# EasyEDA Pro project Fuente Estacion de calor.eprj

# Schematic Schematic1
Board Name: Board1; Create Date: 2025-01-22; Page Name: Fuente; Project Name: Fuente Estacion de calor; Schematic Name: Schematic1; Update Date: 2025-01-21; Company: EasyEDA.com; Page Size: A4; Version: V1.0
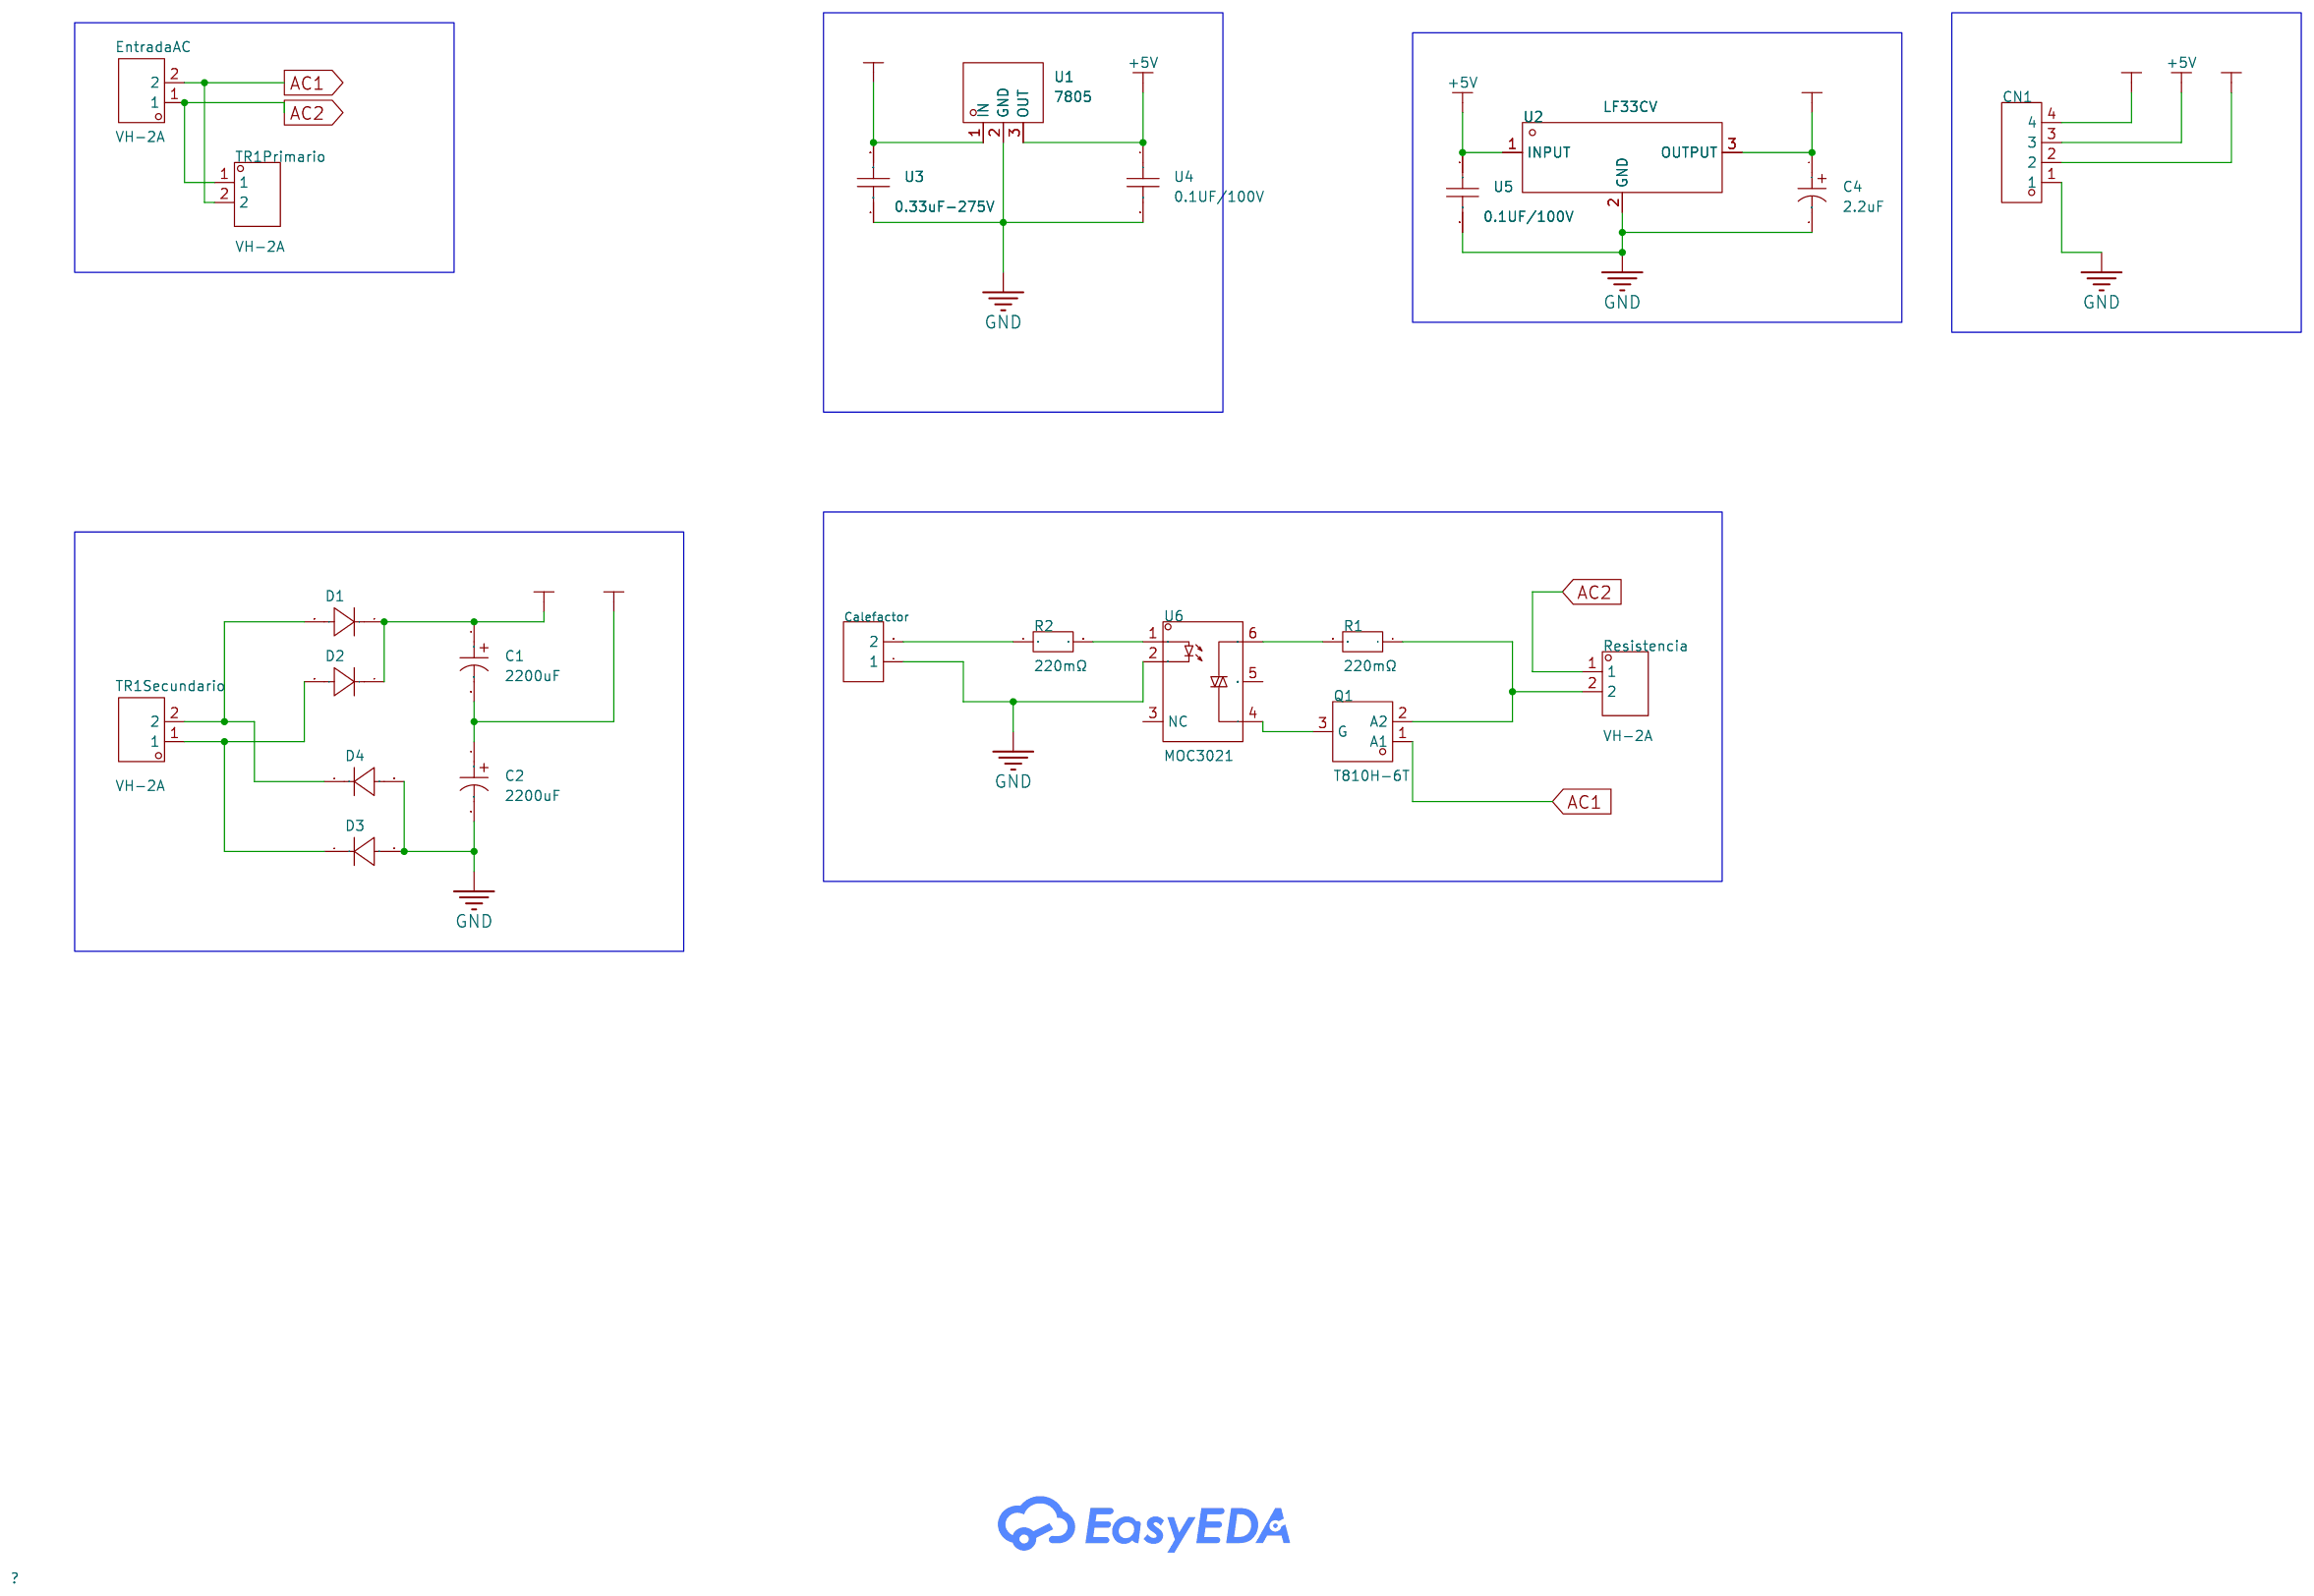
[diagram p0: schematic sheet]

## Parts
C1  2200uF  [CAP-TH_BD18.0-P7.50-D0.8-FD]
C2  2200uF  [CAP-TH_BD18.0-P7.50-D0.8-FD]
C4  2.2uF  [CAP-TH_BD5.0-P2.00-D0.8-FD]
Calefactor  -  [HDR-TH_2P-P2.54-V-F]
CN1  molex 2.54 4P 直针  [CONN-TH_4P-P2.54_C41927]
D1  -  [DO-41_BD2.4-L4.7-P8.70-D0.9-RD]
D2  -  [DO-41_BD2.4-L4.7-P8.70-D0.9-RD]
D3  -  [DO-41_BD2.4-L4.7-P8.70-D0.9-RD]
D4  -  [DO-41_BD2.4-L4.7-P8.70-D0.9-RD]
EntradaAC  VH-2A  [CONN-TH_VH3.96-2A]
Q1  T810H-6T  [ITO-220AB-3_L10.0-W4.5-P2.54-L_1]
R1  220mΩ  [RES-TH_BD2.4-L6.3-P10.30-D0.6]
R2  220mΩ  [RES-TH_BD2.4-L6.3-P10.30-D0.6]
Resistencia  VH-2A  [CONN-TH_VH3.96-2A]
TR1Primario  VH-2A  [CONN-TH_VH3.96-2A]
TR1Secundario  VH-2A  [CONN-TH_VH3.96-2A]
U1  7805  [TO-220-3_L10.0-W4.5-P2.54-L]
U2  LF33CV  [TO-220-3_L10.2-W4.5-P2.54-L]
U3  0.33uF-275V  [CAP-TH_L18.0-W8.4-P15.00-D0.8]
U4  0.1UF/100V  [CAP-TH_L7.0-W3.3-P5.00-D0.4]
U5  0.1UF/100V  [CAP-TH_L7.0-W3.3-P5.00-D0.4]
U6  MOC3021  [DIP-6_L8.5-W6.4-P2.54-LS7.6-BL]

## Library data of the parts
C1 C2 = CD2882281JM1832VFL: LCSC Part Name: 2200uF 63V; Supplier Part: C7493826; Manufacturer: HRK(鸿瑞凯); Supplier Footprint: 插件,D18xL32mm; JLCPCB Part Class: Extended Part; Supplier: LCSC
C4 = 50V2.2uF CD110: LCSC Part Name: 2.2uF ±20% 50V; Supplier Part: C2960206; Manufacturer: HRK(鸿瑞凯电子); Supplier Footprint: 插件,D5xL11mm; JLCPCB Part Class: Extended Part; Datasheet: https://atta.szlcsc.com/upload/public/pdf/source/20220224/498DE033A07BCA0E77D5AA25FF5B4E27.pdf; Supplier: LCSC; Tolerance: ±20%; Operating Temperature: -40℃~+105℃
Calefactor = HDR-F_2.54_1x2P: Supplier Footprint: Through
CN1 = molex 2.54 4P 直针: Supplier Part: C9900020683; Supplier Footprint: molex2.54_4; JLCPCB Part Class: Extended Part; Supplier: LCSC
D1-D4 = 1N4007: Supplier Footprint: DO-41
EntradaAC Resistencia TR1Primario TR1Secundario = VH-2A_C22435737: LCSC Part Name: 1x2P 间距:3.96mm 直插; Supplier Part: C22435737; Manufacturer: DLL(德利); Supplier Footprint: 插件,P=3.96mm; JLCPCB Part Class: Extended Part; Datasheet: https://atta.szlcsc.com/upload/public/pdf/source/20240521/447CE31280736D2A2EC820BDD22F5F15.pdf; Supplier: LCSC; Pins Structure: 1x2P; Pitch: 3.96mm; Mounting Style: Direct Insert; Number of Pins: 2P; Number of Rows: 1; Number of PINs Per Row: 2; Current Rating (Max): 7A; Operating Temperature Range: -40℃~+105℃
Q1 = T810H-6T: Supplier Part: C2971313; Manufacturer: ST(意法半导体); Supplier Footprint: TO-220AB; JLCPCB Part Class: Extended Part; Datasheet: https://atta.szlcsc.com/upload/public/pdf/source/20191219/C472562_6312A7B48CAB40CEF395C5DFD4D8C969.pdf; Supplier: LCSC; Gate Trigger   Voltage (Vgt): 1V; Holding Current (Ih): 25mA; Peak off - state voltage(Vdrm): 600V; Current - Gate Trigger(Igt): 10mA; Current - Surge(Itsm@f): 84A@60Hz; Average Gate Power Dissipation (PG(AV)): 1W; Current - On State(It(RMS)): 8A; Operating Temperature: -40℃~+150℃
R1 R2 = MF0207FTE52-0R22: LCSC Part Name: 金属膜电阻 220mΩ ±1%; Supplier Part: C5120101; Manufacturer: YAGEO(国巨); Supplier Footprint: 插件,D2.4xL6.3mm; JLCPCB Part Class: Extended Part; Datasheet: https://atta.szlcsc.com/upload/public/pdf/source/20220726/D869ABF84827D795EA4F46D364FCE06A.pdf; Supplier: LCSC; Type: Metal Film Resistors; Tolerance: ±1%; Temperature Coefficient: ±50ppm/℃; Operating Temperature: -55℃~+155℃
U1 = 7805_C2843718: Supplier Part: C2843718; Manufacturer: PUOLOP(迪浦); Supplier Footprint: TO-220; JLCPCB Part Class: Extended Part; Datasheet: https://atta.szlcsc.com/upload/public/pdf/source/20210712/C2843718_96B9427BF64C6CE0C1AB214F0C19FF34.pdf; Supplier: LCSC
U2 = LF33CV: LCSC Part Name: 带抑制功能的极低压降稳压器; Supplier Part: C2832779; Manufacturer: ST(意法半导体); Supplier Footprint: TO-220-3; JLCPCB Part Class: Extended Part; Datasheet: https://atta.szlcsc.com/upload/public/pdf/source/20191009/C435902_65B3AAB3204119845CFC8A7586266A6B.pdf; Supplier: LCSC; Output Type: Fixed; Maximum Input Voltage: 16V; Output Voltage: 3.3V; Output Current: 500mA; Dropout Voltage: 700mV@(500mA); standby current: 1mA; Feature: Automotive Standard Certification；Thermal Protection(TSD)；Overcurrent Protection(OCP); Operating Temperature: -40℃~+125℃; Output Polarity: Positive electrode; Number of Outputs: 1
U3 = 0.33uF-275V: Supplier Part: C9900015245; Supplier Footprint: X2_P15; JLCPCB Part Class: Extended Part; Supplier: LCSC
U4 U5 = 0.1UF/100V: Supplier Part: C9900014677; Supplier Footprint: 104; JLCPCB Part Class: Extended Part; Supplier: LCSC
U6 = MOC3021: LCSC Part Name: 双向可控硅 无过零电路 1通道; Supplier Part: C123202; Manufacturer: LITEON(光宝); Supplier Footprint: DIP-6; JLCPCB Part Class: Extended Part; Datasheet: https://atta.szlcsc.com/upload/public/pdf/source/20181205/C123202_F6015C1B1B0CE9E6FC335144C83FD349.pdf; Supplier: LCSC; SCR Type: Two-way thyristor; Zero Crossing Circuit: No; Forward Voltage: 1.15V; Isolation Voltage(rms): 5kV; Forward Current: 50mA; Peak Off-state Voltage(Vdrm): 400V; Static dv/dt: 1000V/us; Number of Outputs: 1; Operating Temperature: -55℃~+110℃

## Nets
12V: C1.2 C2.1 U1.1(IN) U3.2
24V: C1.1 CN1.2 D1.1(K) D2.1(K)
+3.3V: C4.1 CN1.4 U2.3(OUTPUT)
+5V: CN1.3 U1.3(OUT) U2.1(INPUT) U4.1 U5.1
GND: C2.2 C4.2 Calefactor.1 CN1.1 D3.2(A) D4.2(A) U1.2(GND) U2.2(GND) U3.1 U4.2 U5.2 U6.2
AC1: EntradaAC.2 Q1.1(A1) TR1Primario.2
AC2: EntradaAC.1 Resistencia.1 TR1Primario.1
$1N332: D1.2(A) D4.1(K) TR1Secundario.2
$1N337: D2.2(A) D3.1(K) TR1Secundario.1
Net-(Calefactor-2): Calefactor.2 R2.1
Net-(Q1-2): Q1.2(A2) R1.1 Resistencia.2
Net-(Q1-3): Q1.3(G) U6.4(E)
Net-(R1-2): R1.2 U6.6(BASE)
Net-(R2-2): R2.2 U6.1

Not connected (* = marked no-connect by the designer): U6 3(NC) 5(SUB)

# Schematic Schematic2
Board Name: Botones; Create Date: 2025-01-23; Page Name: P1; Project Name: Fuente Estacion de calor; Schematic Name: Schematic2; Update Date: 2025-01-23; Company: EasyEDA.com; Page Size: A4; Version: V1.0
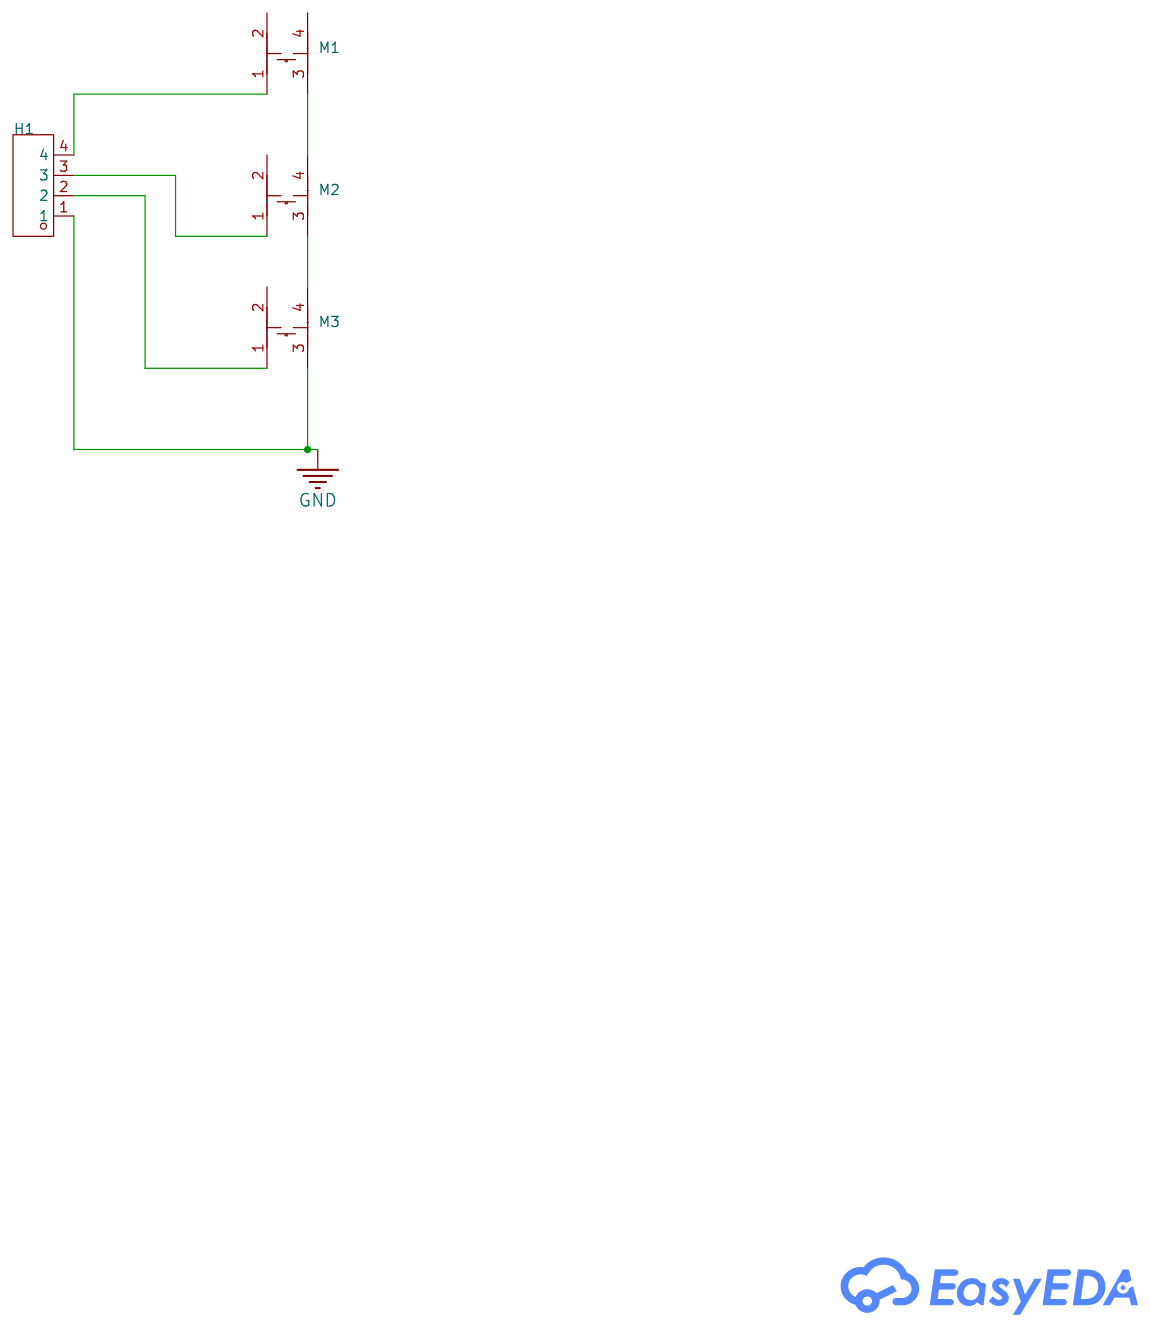
[diagram p1: schematic sheet]

## Parts
H1  FG-PZ2.54-01-04P  [HDR-TH_4P-P2.54-V-M]
M1  B3F-4055 轻触开关  [KEY-TH_4P-L12.0-W12.0-P5.00-LS12.5]
M2  B3F-4055 轻触开关  [KEY-TH_4P-L12.0-W12.0-P5.00-LS12.5]
M3  B3F-4055 轻触开关  [KEY-TH_4P-L12.0-W12.0-P5.00-LS12.5]

## Library data of the parts
H1 = FG-PZ2.54-01-04P: Supplier Part: C42391438; Manufacturer: FG(富港); Supplier Footprint: 插件,P=2.54mm; Datasheet: https://atta.szlcsc.com/upload/public/pdf/source/20241210/62A19982ADC8F0BCD0D04222BA2B3C60.pdf; Supplier: LCSC
M1-M3 = B3F-4055 轻触开关: Supplier Part: C9900012021; Supplier Footprint: SW-TH-4_L12.0-W12.0-P5.00; JLCPCB Part Class: Extended Part; Supplier: LCSC

## Nets
GND: H1.1 M3.3
$1N481: M1.3 M2.4
$1N496: M2.3 M3.4
$1N518: H1.2 M3.1
$1N525: H1.3 M2.1
$1N532: H1.4 M1.1

Not connected (* = marked no-connect by the designer): M1 2 4; M2 2; M3 2

# Board PCB1
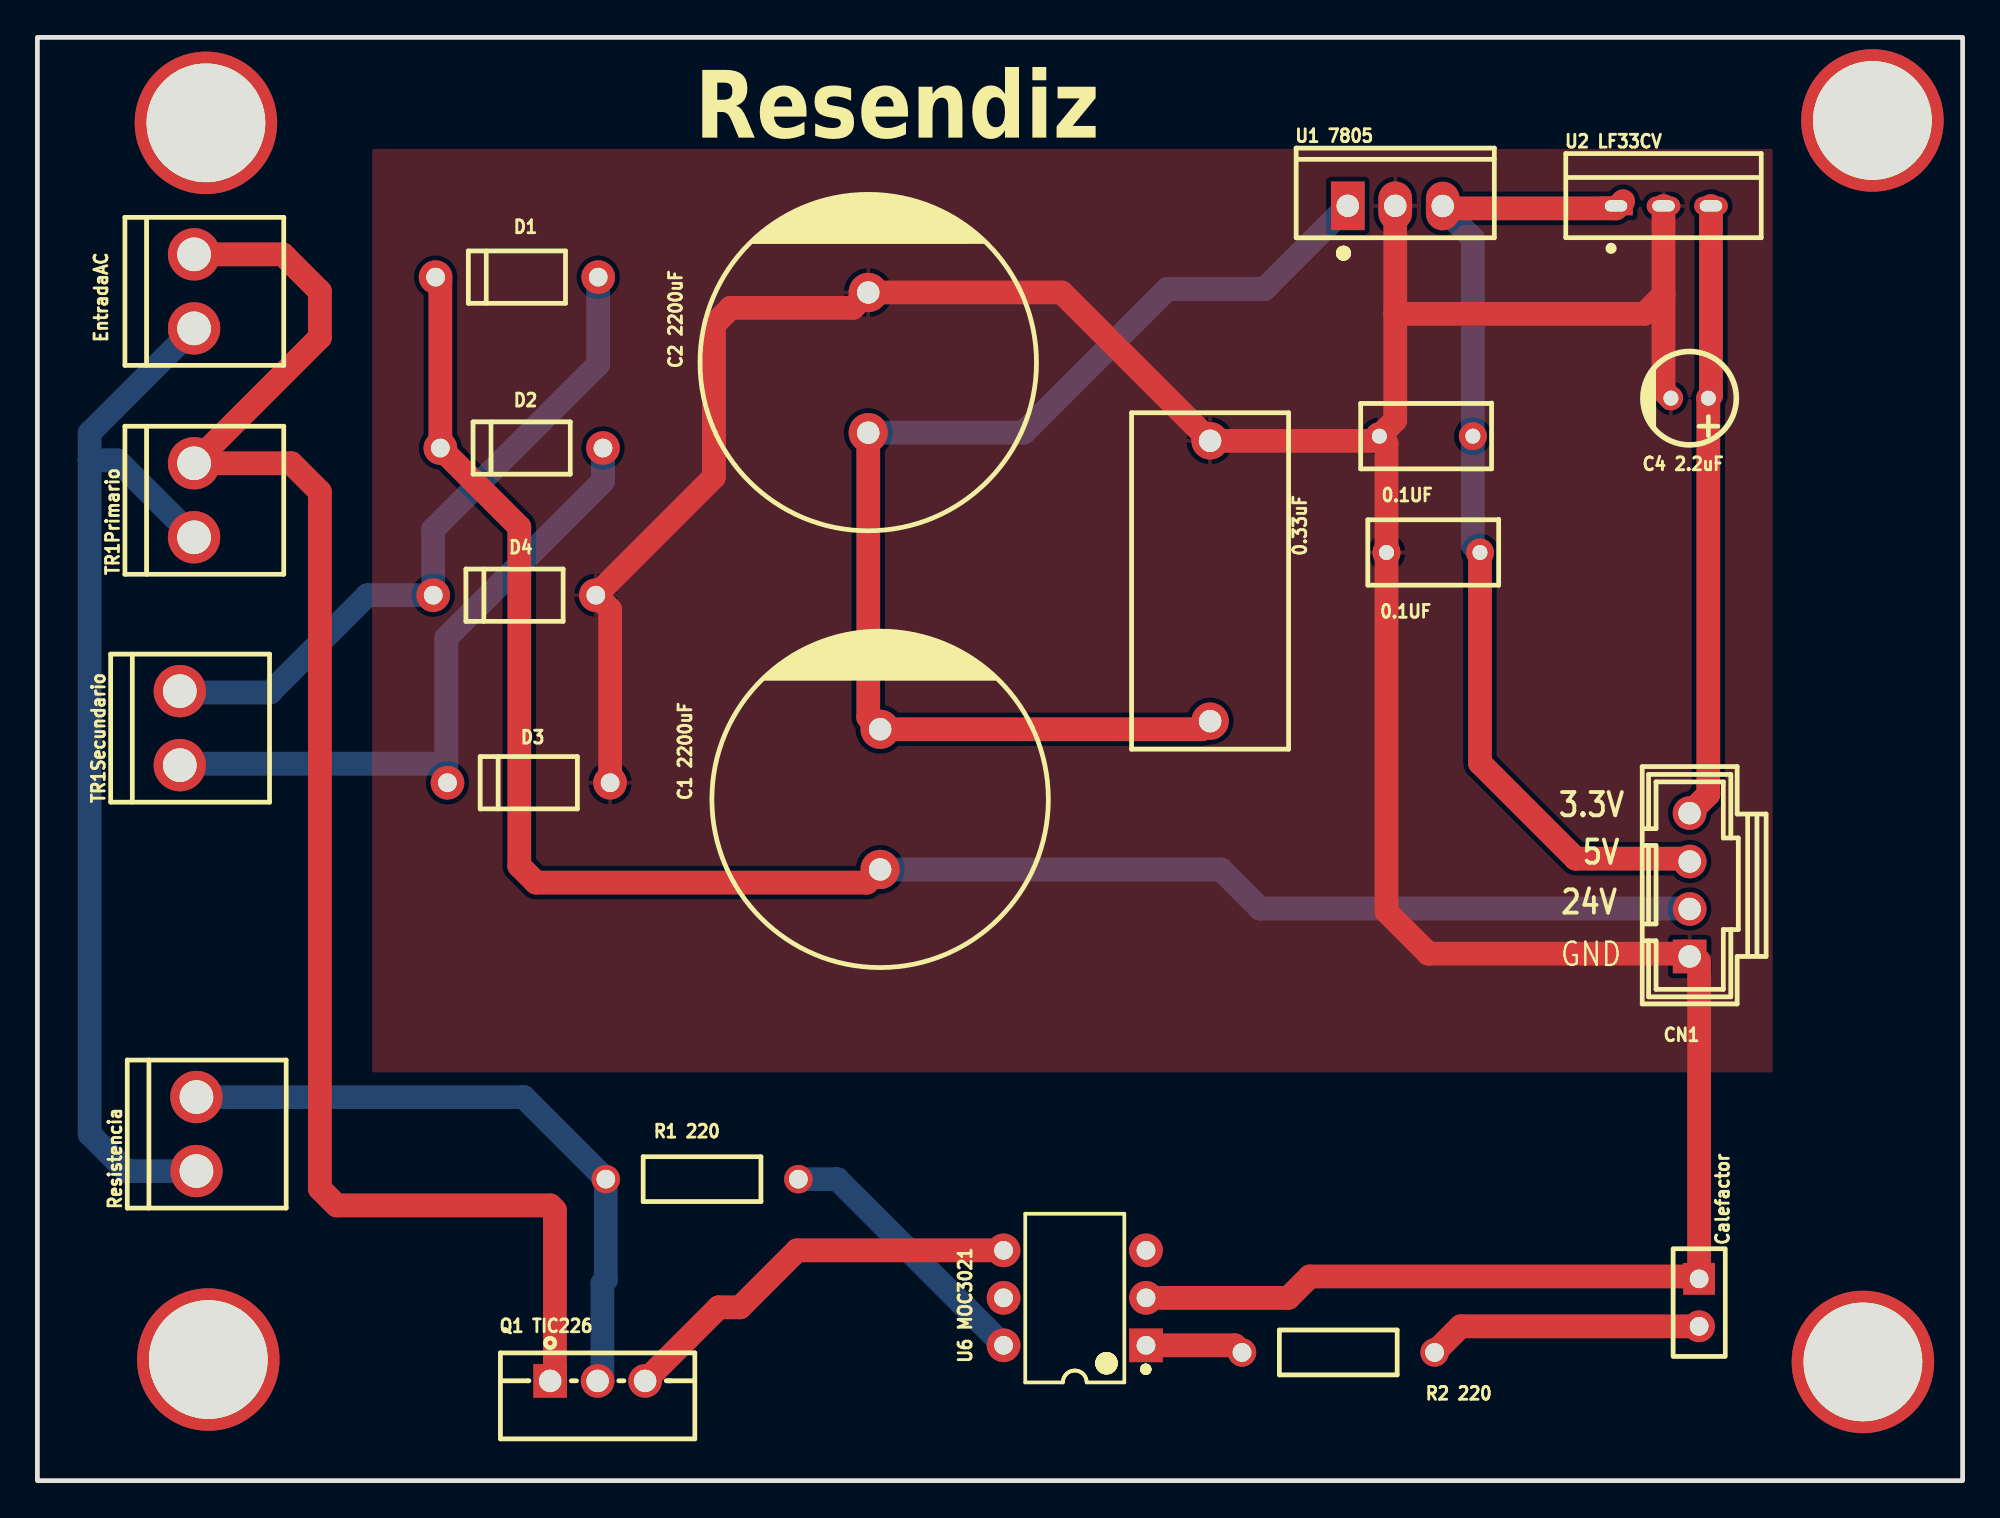
[diagram p2: board, top side]
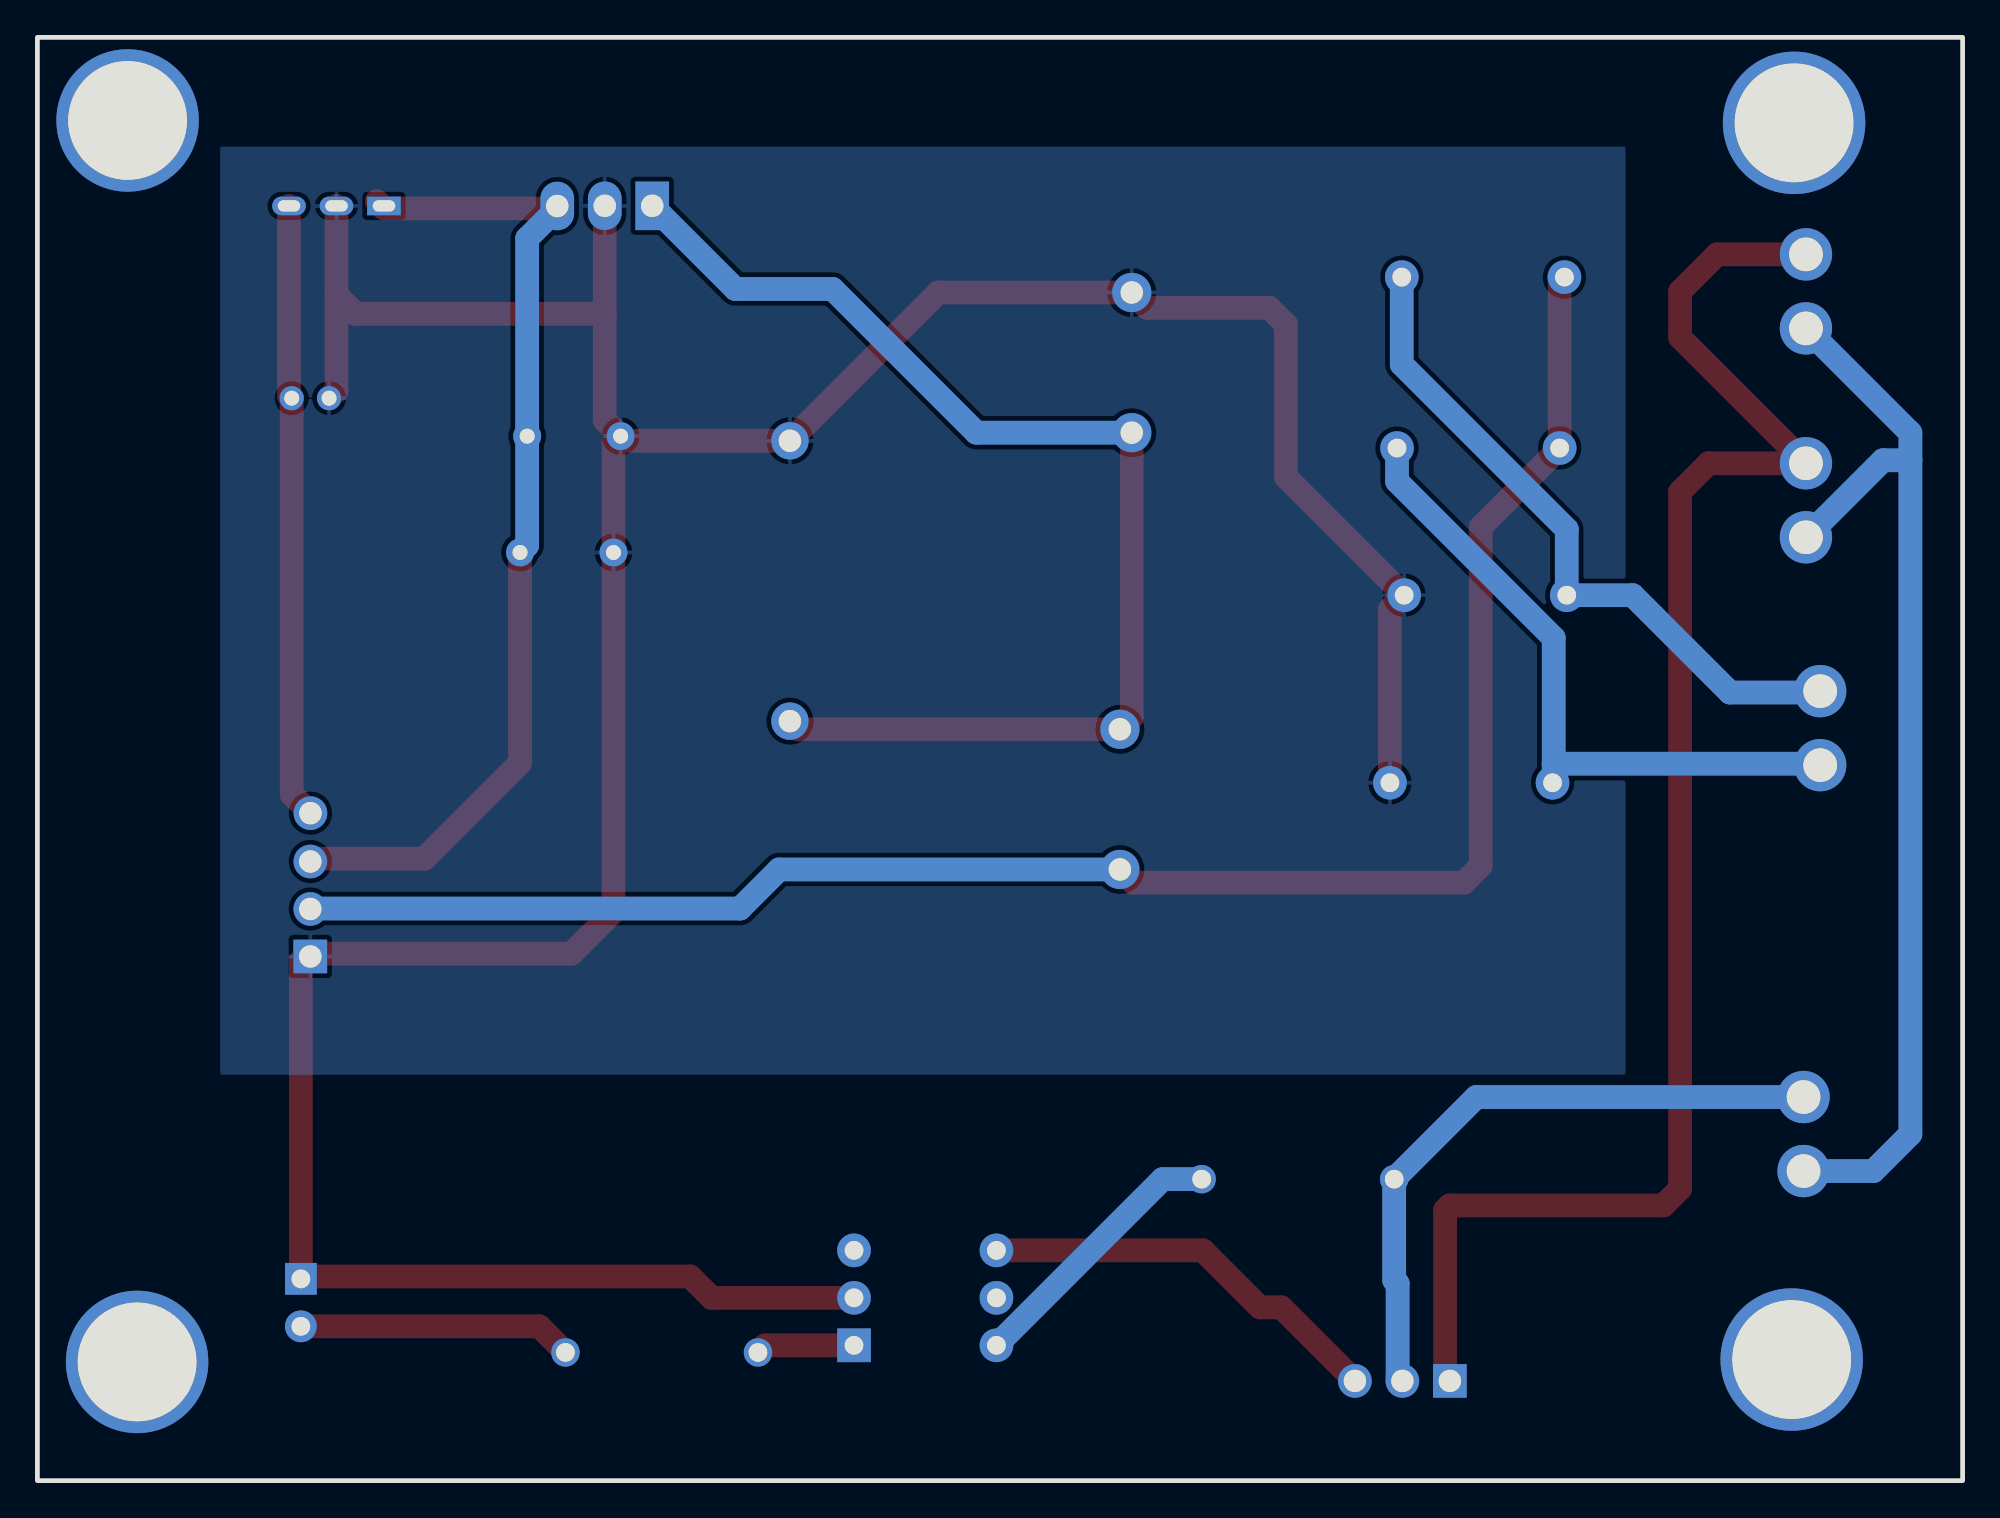
[diagram p3: board, bottom side, seen from below]

Outline 103 x 77.22 mm; copper layers: Top Layer, Bottom Layer. Coordinates in mm from the lower left corner of the outline.
Outline path: rectangle 0,77.22 103,0
Stack: Top Layer 0.035mm / Dielectric1 1.51mm FR4 er 4.5 / Bottom Layer 0.035mm

## Design rules (mm)
template: JLCPCB Capability(Two Layers Board)
spacing copperThickness1oz (default): track to track 0.102, other pairs 0.152 to 0.3
spacing copperThickness2oz: track to track 0.203, other pairs 0.152 to 0.3
track width copperThickness1oz (default): min 0.127, default 0.254, max 2.54
track width copperThickness2oz: min 0.203, default 0.254, max 2.54
differential pair differentialPair (default): width min 0.127, default 0.254, max 2.54; gap min 0.152, default 0.152
via viaSize (default): diameter min 0.5, default 0.61, max 10; hole min 0.3, default 0.305, max 6.3

## Placement (name value [footprint] x y rotation side)
0.1UF  -  [CAP-TH_L7.0-W3.3-P5.00-D0.4]  74.3 55.88 180 top
0.1UF#2  -  [CAP-TH_L7.0-W3.3-P5.00-D0.4]  74.68 49.66 180 top
0.33uF  0.33uF-275V  [CAP-TH_L18.0-W8.4-P15.00-D0.8]  62.74 48.13 270 top
C1 2200uF  2200uF  [CAP-TH_BD18.0-P7.50-D0.8-FD]  45.08 36.45 90 top
C2 2200uF  2200uF  [CAP-TH_BD18.0-P7.50-D0.8-FD]  44.45 59.82 90 top
C4 2.2uF  2.2uF  [CAP-TH_BD5.0-P2.00-D0.8-FD]  88.39 57.91 180 top
Calefactor  -  [HDR-TH_2P-P2.54-V-F]  88.9 9.53 270 top
CN1  molex 2.54 4P 直针  [CONN-TH_4P-P2.54_C41927]  88.39 31.88 90 top
D1  -  [DO-41_BD2.4-L4.7-P8.70-D0.9-RD]  25.65 64.39 0 top
D2  -  [DO-41_BD2.4-L4.7-P8.70-D0.9-RD]  25.91 55.24 0 top
D3  -  [DO-41_BD2.4-L4.7-P8.70-D0.9-RD]  26.29 37.34 0 top
D4  -  [DO-41_BD2.4-L4.7-P8.70-D0.9-RD]  25.53 47.37 0 top
EntradaAC  VH-2A  [CONN-TH_VH3.96-2A]  8.38 63.63 90 top
NOREF  -  [Pad_e411]  98.17 72.77 0 top
NOREF#2  -  [Pad_e405]  9.02 72.64 0 top
NOREF#3  -  [Pad_e408]  9.14 6.48 0 top
NOREF#4  -  [Pad_e409]  97.66 6.35 0 top
Q1 TIC226  T810H-6T  [ITO-220AB-3_L10.0-W4.5-P2.54-L_1]  29.97 5.33 0 top
R1 220  220mΩ  [RES-TH_BD2.4-L6.3-P10.30-D0.6]  35.56 16.13 0 top
R2 220  220mΩ  [RES-TH_BD2.4-L6.3-P10.30-D0.6]  69.6 6.86 180 top
Resistencia  VH-2A  [CONN-TH_VH3.96-2A]  8.51 18.54 90 top
TR1Primario  VH-2A  [CONN-TH_VH3.96-2A]  8.38 52.45 90 top
TR1Secundario  VH-2A  [CONN-TH_VH3.96-2A]  7.62 40.26 90 top
U1 7805  7805  [TO-220-3_L10.0-W4.5-P2.54-L]  72.64 68.2 0 top
U2 LF33CV  LF33CV  [TO-220-3_L10.2-W4.5-P2.54-L]  86.99 68.2 0 top
U6 MOC3021  MOC3021  [DIP-6_L8.5-W6.4-P2.54-LS7.6-BL]  55.5 9.78 90 top

## Footprints (pads in the part's own frame, mm; a bottom-side part is the same pattern mirrored in y, then rotated)
CAP-TH_BD5.0-P2.00-D0.8-FD
  round 1.3 hole 0.8: 1(-1,0) 2(1,0)
CAP-TH_BD18.0-P7.50-D0.8-FD
  round 2.1 hole 1.2: 1(-3.75,0) 2(3.75,0)
CAP-TH_L7.0-W3.3-P5.00-D0.4
  round 1.5 hole 0.8: 1(-2.5,0) 2(2.5,0)
CAP-TH_L18.0-W8.4-P15.00-D0.8
  round 2 hole 1.2: 1(-7.5,0) 2(7.5,0)
CONN-TH_4P-P2.54_C41927
  rect 1.8x1.8 hole 1.2: 1(-3.833,-0.004)
  round 1.8 hole 1.2: 2(-1.294,-0.004) 3(1.246,-0.004) 4(3.833,0.004)
CONN-TH_VH3.96-2A
  round 2.8 hole 1.8: 1(-1.98,0) 2(1.98,0)
DIP-6_L8.5-W6.4-P2.54-LS7.6-BL
  rect 1.8x1.8 hole 1: 1(-2.54,-3.81)
  round 1.8 hole 1: 2(0,-3.81) 3(2.54,-3.81) 4(2.54,3.81) 5(0,3.81) 6(-2.54,3.81)
DO-41_BD2.4-L4.7-P8.70-D0.9-RD
  round 1.8 hole 1: 1(-4.35,0) 2(4.35,0)
HDR-TH_2P-P2.54-V-F
  rect 1.7x1.7 hole 1: 1(-1.27,0)
  round 1.7 hole 1: 2(1.27,0)
ITO-220AB-3_L10.0-W4.5-P2.54-L_1
  rect 1.8x1.8 hole 1.2: 1(-2.54,0)
  round 1.8 hole 1.2: 2(0,0) 3(2.54,0)
Pad_e405
  round 7.62 hole 6.35: 1(0,0)
Pad_e408
  round 7.62 hole 6.35: 1(0,0)
Pad_e409
  round 7.62 hole 6.35: 1(0,0)
Pad_e411
  round 7.62 hole 6.35: 1(0,0)
RES-TH_BD2.4-L6.3-P10.30-D0.6
  round 1.524 hole 1: 1(-5.15,0) 2(5.15,0)
TO-220-3_L10.0-W4.5-P2.54-L
  rect 1.8x2.6 hole 1.2: 1(-2.54,0.005)
  oval 1.8x2.6 hole 1.2: 2(0,0.005) 3(2.54,-0.005)
TO-220-3_L10.2-W4.5-P2.54-L
  rect 1.8x1 hole 1.2x0.6: 1(-2.54,0)
  oval 1.8x1 hole 1.2x0.6: 2(0,0) 3(2.54,0)

## Nets
12V: 0.33uF.2 C1 2200uF.2 C2 2200uF.1 U1 7805.1
24V: C1 2200uF.1 CN1.2 D1.1 D2.1
+3.3V: C4 2.2uF.1 CN1.4 U2 LF33CV.3
+5V: 0.1UF.1 0.1UF#2.1 CN1.3 U1 7805.3 U2 LF33CV.1
GND: 0.1UF.2 0.1UF#2.2 0.33uF.1 C2 2200uF.2 C4 2.2uF.2 Calefactor.1 CN1.1 D3.2 D4.2 U1 7805.2 U2 LF33CV.2 U6 MOC3021.2
AC1: EntradaAC.2 Q1 TIC226.1 TR1Primario.2
AC2: EntradaAC.1 Resistencia.1 TR1Primario.1
$1N332: D1.2 D4.1 TR1Secundario.2
$1N337: D2.2 D3.1 TR1Secundario.1
$1N1698: Q1 TIC226.2 R1 220.1 Resistencia.2
$1N1932: R1 220.2 U6 MOC3021.6
$1N1936: Q1 TIC226.3 U6 MOC3021.4
$1N2002: R2 220.2 U6 MOC3021.1
$1N2295: Calefactor.2 R2 220.1

Pads without a net: NOREF 1; NOREF#2 1; NOREF#3 1; NOREF#4 1; U6 MOC3021 3 5

## Routing (per net, layer and track width the routed paths; a pad name or vN(x,y) marks a point on that pad's centre or on a via; arc(x,y) is an arc through that point)
12V: length 64.6
  Top Layer w1.27: 0.33uF.2 62.3,40.2 C1 2200uF.2 44.45,40.83 C2 2200uF.1
  Bottom Layer w1.27: C2 2200uF.1 52.77,56.07 60.45,63.75 65.65,63.75 U1 7805.1
24V: length 97.5
  Top Layer w1.27: D1.1 21.56,64.13 D2.1 25.78,51.02 25.78,32.89 26.68,31.99 44.38,31.99 C1 2200uF.1
  Bottom Layer w1.27: CN1.2 88.37,30.61 65.41,30.61 63.31,32.7 C1 2200uF.1
+3.3V: length 33
  Top Layer w1.27: 89.54,68.2 89.54,58.05 C4 2.2uF.1 89.39,36.71 CN1.4
+5V: length 53.7
  Top Layer w1.27: CN1.3 88.24,33.27 82.3,33.27 77.18,38.39 0.1UF#2.1 ; 75.18,68.07 84.45,68.07 84.84,68.45
  Bottom Layer w1.27: 0.1UF#2.1 76.8,50.04 0.1UF.1 76.8,66.46 75.18,68.07
GND: length 195.5
  Top Layer w1.27: 86.99,63.44 86.99,58.31 C4 2.2uF.2 ; 86.99,63.44 U2 LF33CV.2 ; 86.99,63.44 85.98,62.43 72.64,62.43 ; 88.24,28.19 74.42,28.19 72.18,30.44 0.1UF#2.2 72.18,55.5 0.1UF.2 ; 88.24,28.19 88.13,28.31 ; 88.24,28.19 CN1.1 88.76,27.68 ; 72.64,62.43 72.64,68.08 ; 72.64,62.43 72.64,56.73 0.1UF.2 ; 0.1UF.2 71.55,55.63 0.33uF.1 54.8,63.57 C2 2200uF.2 43.63,62.75 37.09,62.75 36.2,61.85 36.2,53.69 D4.2 30.64,46.61 D3.2 ; 88.9,27.81 Calefactor.1 88.77,10.92 68.07,10.92 66.93,9.78 U6 MOC3021.2
AC1: length 86.5
  Top Layer w1.27: EntradaAC.2 13.13,65.61 15.11,63.63 15.11,61.16 TR1Primario.2 13.59,54.43 15.11,52.91 15.11,15.62 16.01,14.72 27.44,14.72 27.69,14.48 27.69,5.59 Q1 TIC226.1
AC2: length 59.2
  Bottom Layer w1.27: Resistencia.1 4.77,16.56 2.79,18.54 2.79,54.59 ; TR1Primario.1 4.26,54.59 2.79,54.59 ; EntradaAC.1 2.79,56.06 2.79,54.59
$1N332: length 36.4
  Bottom Layer w1.27: TR1Secundario.2 7.7,42.16 12.45,42.16 17.65,47.37 D4.1 21.18,50.89 30,59.72 D1.2
$1N337: length 35.8
  Bottom Layer w1.27: D2.2 30.26,53.47 21.88,45.08 21.88,38.35 ; 21.88,38.35 21.88,37.27 21.81,37.21 ; 21.88,38.35 7.7,38.35 TR1Secundario.1
$1N1698: length 34.7
  Bottom Layer w1.27: Q1 TIC226.2 30.23,5.59 30.23,10.54 30.41,10.72 R1 220.1 26.02,20.52 8.51,20.52
$1N1932: length 14.7
  Bottom Layer w1.27: R1 220.2 42.8,16.13 U6 MOC3021.6
$1N1936: length 22.1
  Top Layer w1.27: Q1 TIC226.3 36.45,9.27 37.59,9.27 40.64,12.32 U6 MOC3021.4
$1N2295: length 14.7
  Top Layer w1.27: R2 220.1 76.14,8.25 Calefactor.2
$1N2002: length 5.3
  Top Layer w1.27: U6 MOC3021.1 64.07,7.24 R2 220.2

## Copper pours and planes (outline as drawn; the poured copper is in the pictures)
GND on Top Layer: 17.91,71.25 92.84,71.25 92.84,21.84 17.91,21.84
GND on Bottom Layer: 18.03,71.37 93.22,71.37 93.22,21.72 18.03,21.72

## Text on the board
Top Silkscreen Layer: GND | 3.3V | 24V | 5V | Resendiz

# Board PCB2
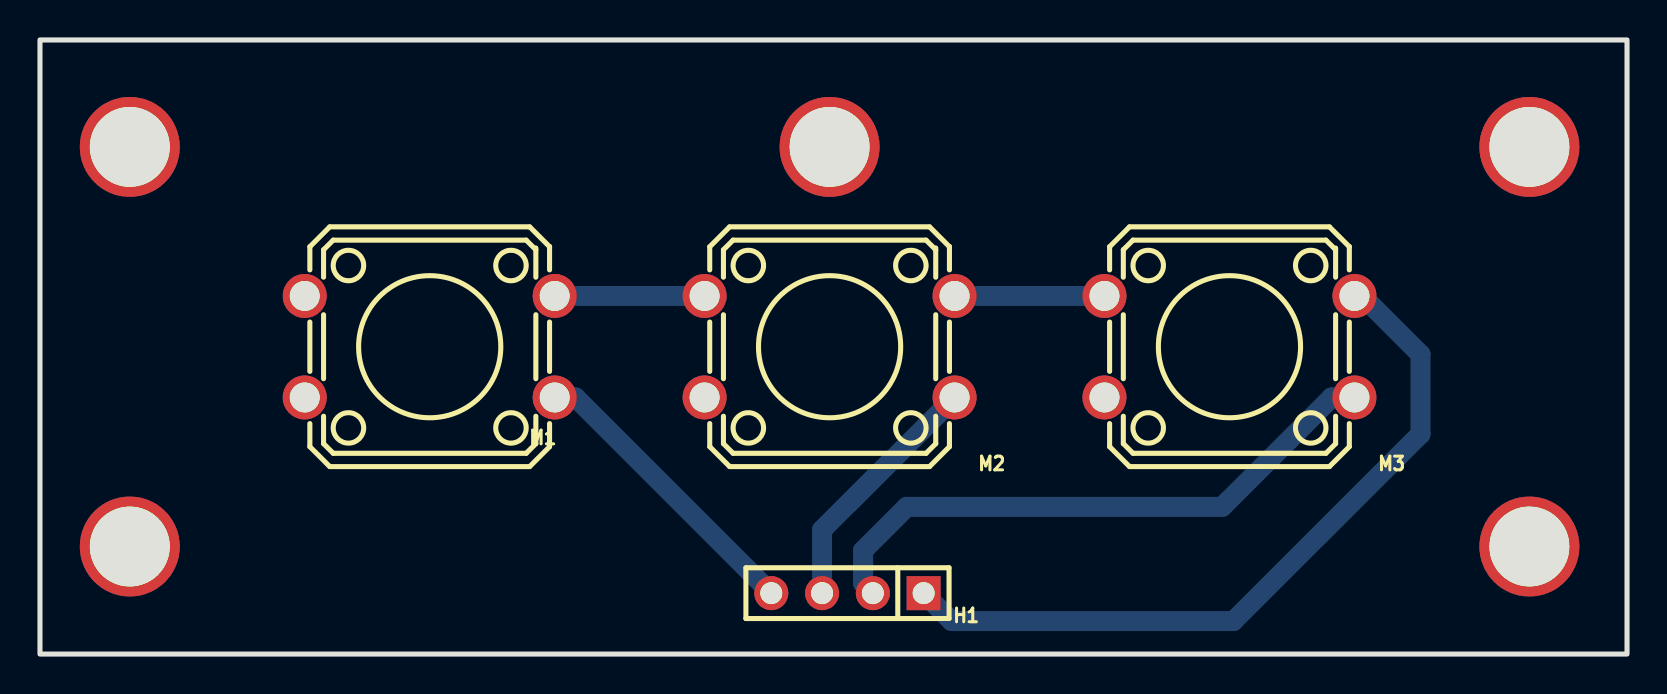
[diagram p4: board, top side]
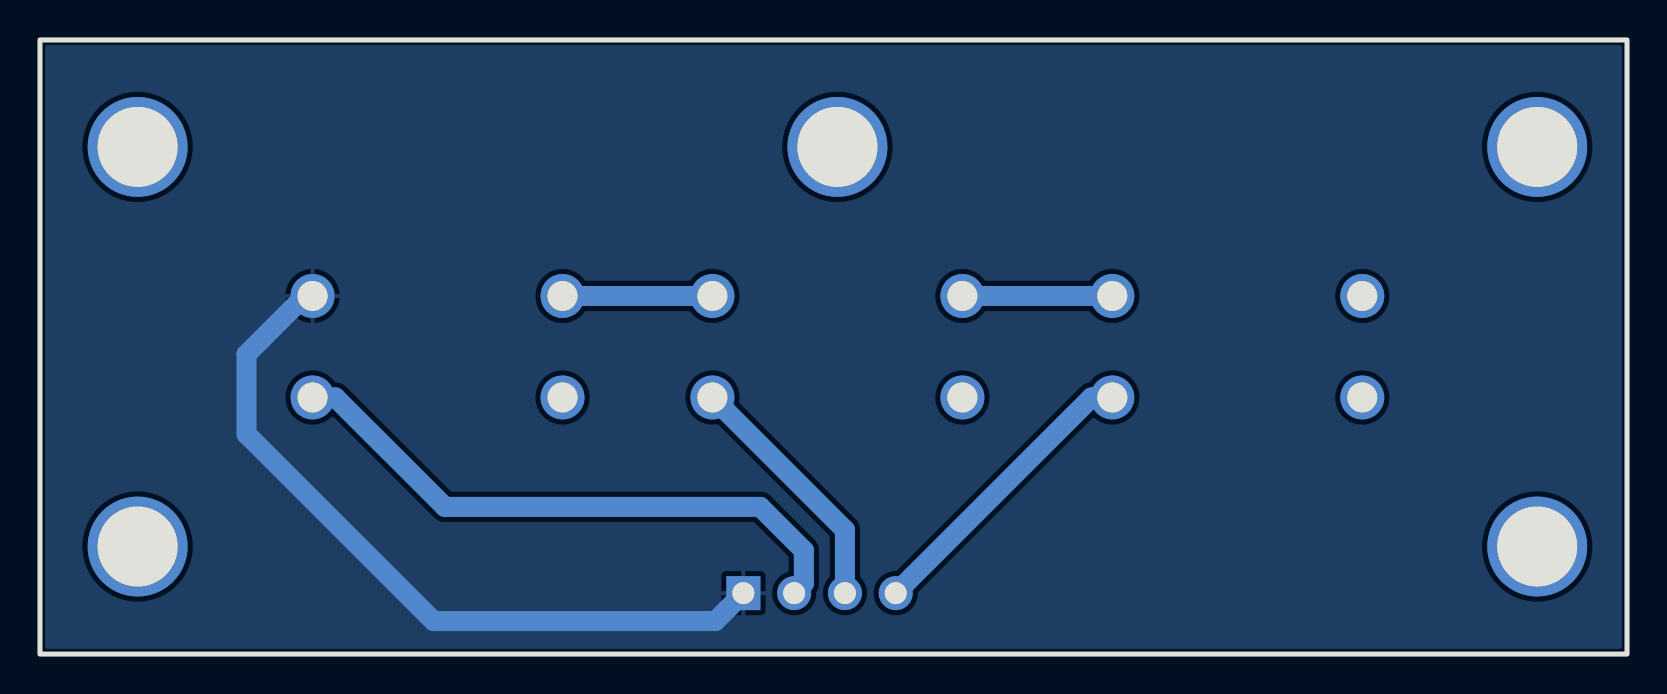
[diagram p5: board, bottom side, seen from below]

Outline 79.38 x 30.73 mm; copper layers: Top Layer, Bottom Layer. Coordinates in mm from the lower left corner of the outline.
Outline path: rectangle 0,30.73 79.38,0
Stack: Top Layer 0.035mm / Dielectric1 1.51mm FR4 er 4.5 / Bottom Layer 0.035mm

## Design rules (mm)
template: JLCPCB Capability(Two Layers Board)
spacing copperThickness1oz (default): track to track 0.102, other pairs 0.152 to 0.3
spacing copperThickness2oz: track to track 0.203, other pairs 0.152 to 0.3
track width copperThickness1oz (default): min 0.127, default 0.254, max 2.54
track width copperThickness2oz: min 0.203, default 0.254, max 2.54
differential pair differentialPair (default): width min 0.127, default 0.254, max 2.54; gap min 0.152, default 0.152
via viaSize (default): diameter min 0.5, default 0.61, max 10; hole min 0.3, default 0.305, max 6.3

## Placement (name value [footprint] x y rotation side)
H1  FG-PZ2.54-01-04P  [HDR-TH_4P-P2.54-V-M]  40.39 3.05 180 top
M1  B3F-4055 轻触开关  [KEY-TH_4P-L12.0-W12.0-P5.00-LS12.5]  19.49 15.38 180 top
M2  B3F-4055 轻触开关  [KEY-TH_4P-L12.0-W12.0-P5.00-LS12.5]  39.49 15.38 180 top
M3  B3F-4055 轻触开关  [KEY-TH_4P-L12.0-W12.0-P5.00-LS12.5]  59.49 15.38 180 top
NOREF  -  [Pad_e14]  4.49 5.38 0 top
NOREF#2  -  [Pad_e16]  74.49 25.38 0 top
NOREF#3  -  [Pad_e15]  74.49 5.38 0 top
NOREF#4  -  [Pad_e12]  4.49 25.38 0 top
NOREF#5  -  [Pad_e101]  39.49 25.38 0 top

## Footprints (pads in the part's own frame, mm; a bottom-side part is the same pattern mirrored in y, then rotated)
HDR-TH_4P-P2.54-V-M
  rect 1.7x1.7 hole 1.1: 1(-3.81,0)
  round 1.7 hole 1.1: 2(-1.27,0) 3(1.27,0) 4(3.81,0)
KEY-TH_4P-L12.0-W12.0-P5.00-LS12.5
  round 2.2 hole 1.5: 1(-6.251,2.54) 2(6.251,2.54) 3(-6.251,-2.54) 4(6.251,-2.54)
Pad_e12
  round 5 hole 4: 1(0,0)
Pad_e14
  round 5 hole 4: 1(0,0)
Pad_e15
  round 5 hole 4: 1(0,0)
Pad_e16
  round 5 hole 4: 1(0,0)
Pad_e101
  round 5 hole 4: 1(0,0)

## Nets
As in the schematic.

Pads without a net: M1 2 4; M2 2; M3 2; NOREF 1; NOREF#2 1; NOREF#3 1; NOREF#4 1; NOREF#5 1

## Routing (per net, layer and track width the routed paths; a pad name or vN(x,y) marks a point on that pad's centre or on a via; arc(x,y) is an arc through that point)
GND: length 37.8
  Bottom Layer w1: H1.1 45.59,1.65 59.69,1.65 69.05,11.01 69.05,15 66.12,17.92 M3.3
$1N481: length 7.5
  Bottom Layer w1: M1.3 M2.4
$1N496: length 7.5
  Bottom Layer w1: M2.3 M3.4
$1N518: length 30.1
  Bottom Layer w1: M3.1 64.6,12.84 59.13,7.37 43.35,7.37 41.17,5.18 41.17,3.53 H1.2
$1N525: length 12.5
  Bottom Layer w1: M2.1 39.12,6.21 H1.3
$1N532: length 14.9
  Bottom Layer w1: M1.1 26.78,12.84 H1.4

## Copper pours and planes (outline as drawn; the poured copper is in the pictures)
GND on Bottom Layer: 0.19,30.73 79.38,30.73 79.38,0 0.19,0
